# Altium schematic sheet KNoT_Thing_Starter2_Board.SchDoc
size A
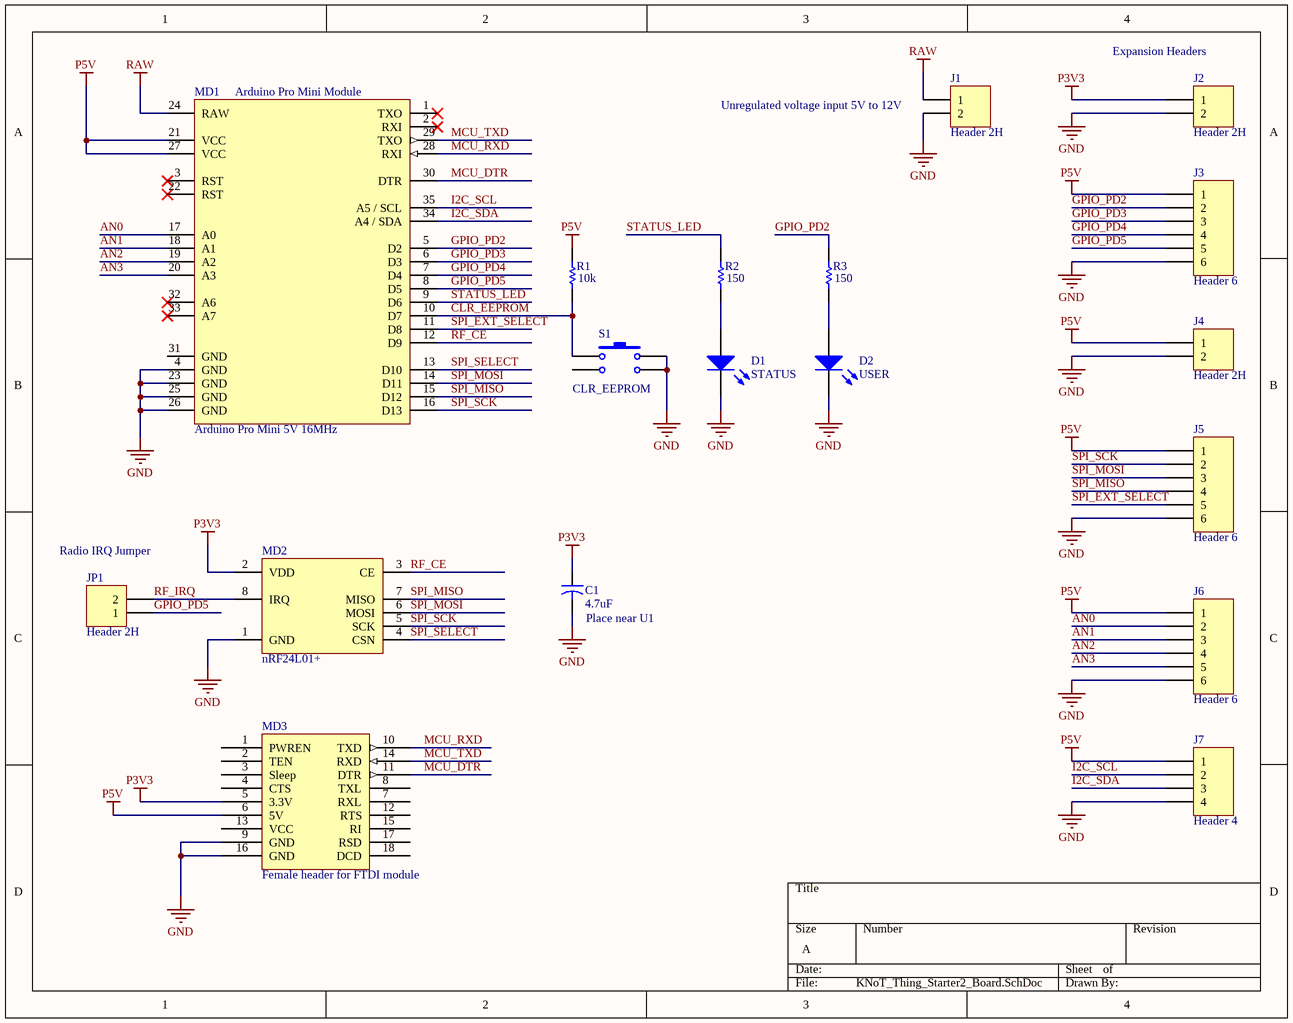
[diagram p0: KNoT_Thing_Starter2_Board.SchDoc]

## Parts
C1  value 4.7uF  [CAP RADIAL 5mm]  (hidden comment: CAPC_RADIAL_100)
D1  STATUS  [LED]
D2  USER  [LED]
J1  Header 2H  [HDR1X2]
J2  Header 2H  [HDR1X2]
J3  Header 6  [HDR1X6]
J4  Header 2H  [HDR1X2]
J5  Header 6  [HDR1X6]
J6  Header 6  [HDR1X6]
J7  Header 4  [HDR1X4]
JP1  Header 2H  [HDR1X2]
MD1  Arduino Pro Mini 5V 16MHz  [Arduino Pro Mini]
MD2  nRF24L01+  [nRF24L01+ Module]
MD3  Female header for FTDI module  [FTDI_Module]
R1  value 10k  [AXIAL-3mm]  (hidden comment: Res1)
R2  value 150  [AXIAL-3mm]  (hidden comment: Res1)
R3  value 150  [AXIAL-3mm]  (hidden comment: Res1)
S1  CLR_EEPROM  [SW-TACT]

## Nets
GND: C1.2 D1.2(K) D2.2(K) J1.2 J2.2 J3.6 J4.2 J5.6 J6.6 J7.4 MD1.4(GND) MD1.23(GND) MD1.25(GND) MD1.26(GND) MD2.1(GND) MD3.9(GND) MD3.16(GND) S1.3 S1.4
P3V3: C1.1 J2.1 MD2.2(VDD) MD3.5(3.3V)
P5V: J3.1 J4.1 J5.1 J6.1 J7.1 MD1.21(VCC) MD1.27(VCC) MD3.6(5V) R1.1
RAW: J1.1 MD1.24(RAW)
AN0: J6.2 MD1.17(A0)
AN1: J6.3 MD1.18(A1)
AN2: J6.4 MD1.19(A2)
AN3: J6.5 MD1.20(A3)
CLR_EEPROM: MD1.10(D7) R1.2 S1.1
GPIO_PD2: J3.2 MD1.5(D2) R3.1
GPIO_PD3: J3.3 MD1.6(D3)
GPIO_PD4: J3.4 MD1.7(D4)
GPIO_PD5: J3.5 JP1.1 MD1.8(D5)
I2C_SCL: J7.2 MD1.35(A5_/_SCL)
I2C_SDA: J7.3 MD1.34(A4_/_SDA)
MCU_DTR: MD1.30(DTR) MD3.11(DTR)
MCU_RXD: MD1.28(RXI) MD3.10(TXD)
MCU_TXD: MD1.29(TXO) MD3.14(RXD)
RF_CE: MD1.12(D9) MD2.3(CE)
RF_IRQ: JP1.2 MD2.8(IRQ)
SPI_EXT_SELECT: J5.5 MD1.11(D8)
SPI_MISO: J5.4 MD1.15(D12) MD2.7(MISO)
SPI_MOSI: J5.3 MD1.14(D11) MD2.6(MOSI)
SPI_SCK: J5.2 MD1.16(D13) MD2.5(SCK)
SPI_SELECT: MD1.13(D10) MD2.4(CSN)
STATUS_LED: MD1.9(D6) R2.1
NetD1_1: D1.1(A) R2.2
NetD2_1: D2.1(A) R3.2

Not connected (* = marked no-connect by the designer): MD1 1(TXO)* 2(RXI)* 3(RST)* 22(RST)* 31(GND) 32(A6)* 33(A7)*; MD3 1(PWREN) 2(TEN) 3(Sleep) 4(CTS) 7(RXL) 8(TXL) 12(RTS) 13(VCC) 15(RI) 17(RSD) 18(DCD); S1 2

## Notes on the sheet
- (near MD1) Arduino Pro Mini Module
- (near J2) Expansion Headers
- (near J1) Unregulated voltage input 5V to 12V
- (near JP1) Radio IRQ Jumper
- (near C1) Place near U1

## Library data of the parts
C1 = CAPC1608L_1: Capacitor Radial 4.7µF; Published: 23-Sep-2002; PackageReference: CC0603KRX5R6BB475; Publisher: Altium Limited; PackageDescription: Capacitor; 2 Leads; Supplier 1: Digi-Key; Supplier Part Number 1: P1175-ND
D1 D2 = LED: Typical RED, GREEN, YELLOW, AMBER GaAs LED; Published: 8-Jun-2000; LatestRevisionDate: 17-Jul-2002; LatestRevisionNote: Re-released for DXP Platform.; PackageVersion: Feb-2002; PackageReference: 3.2X1.6X1.1; Publisher: Altium Limited; PackageDescription: SM LED; 2 Flat Leads; Supplier 1: Digi-Key
  D1: Supplier Part Number 1: C503B-RCN-CW0Z0AA1-ND
  D2: Supplier Part Number 1: 516-1337-ND
J1 J2 J4 JP1 = Header 2H: Header, 2-Pin, Right Angle; LatestRevisionDate: 17-Jul-2002; LatestRevisionNote: Re-released for DXP Platform.; Publisher: Altium Limited
J3 J5 J6 = Header 6: Header, 6-Pin; LatestRevisionDate: 17-Jul-2002; LatestRevisionNote: Re-released for DXP Platform.; Publisher: Altium Limited
J7 = Header 4: Header, 4-Pin; LatestRevisionDate: 17-Jul-2002; LatestRevisionNote: Re-released for DXP Platform.; Publisher: Altium Limited
MD2 = nRF24L01+ Module: 2x4 Female Header Conector
MD3 = Module_FTDI: Connection header for custom FTDI module
R1-R3 = Res1: Resistor; Published: 8-Jun-2000; LatestRevisionDate: 17-Jul-2002; LatestRevisionNote: Re-released for DXP Platform.; PackageReference: AXIAL-0.3; Publisher: Altium Limited; PackageDescription: Axial Device, Thru-Hole; 2 Leads; 0.3 in Pin Spacing; Supplier 1: Digi-Key
  R1: Supplier Part Number 1: CF18JT10K0CT-ND
  R2 R3: Supplier Part Number 1: CF18JT150RCT-ND
S1 = SW-PB: B3F-1002 SWITCH TACT 6MM MOM 150GF; Published: 24-Mar-1999; LatestRevisionDate: 17-Jul-2002; LatestRevisionNote: Re-released for DXP Platform.; PackageReference: SPST-2; Publisher: Altium Limited; Supplier 1: Digi-Key; Supplier Part Number 1: 450-1804-ND